# EAGLE schematic Johnson (EAGLE 8.5.1)
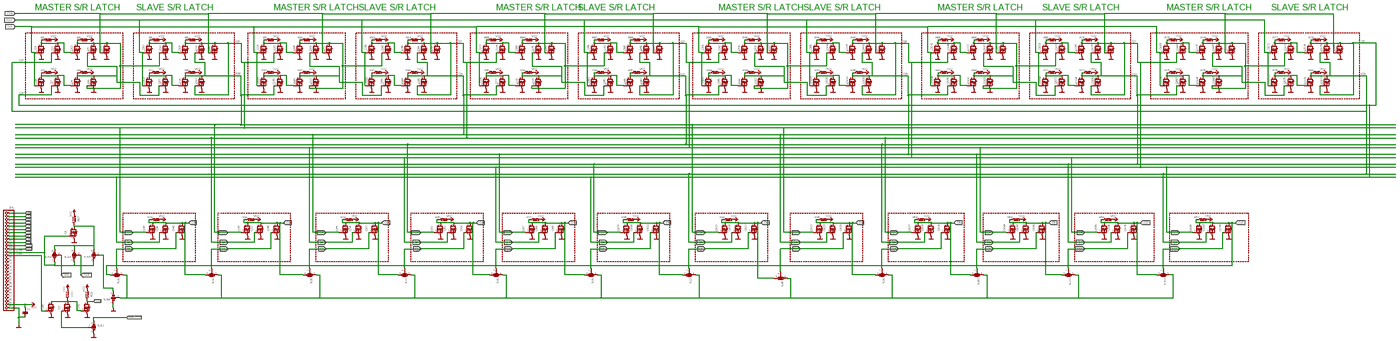
[diagram p0: schematic, sheet 1, overview]
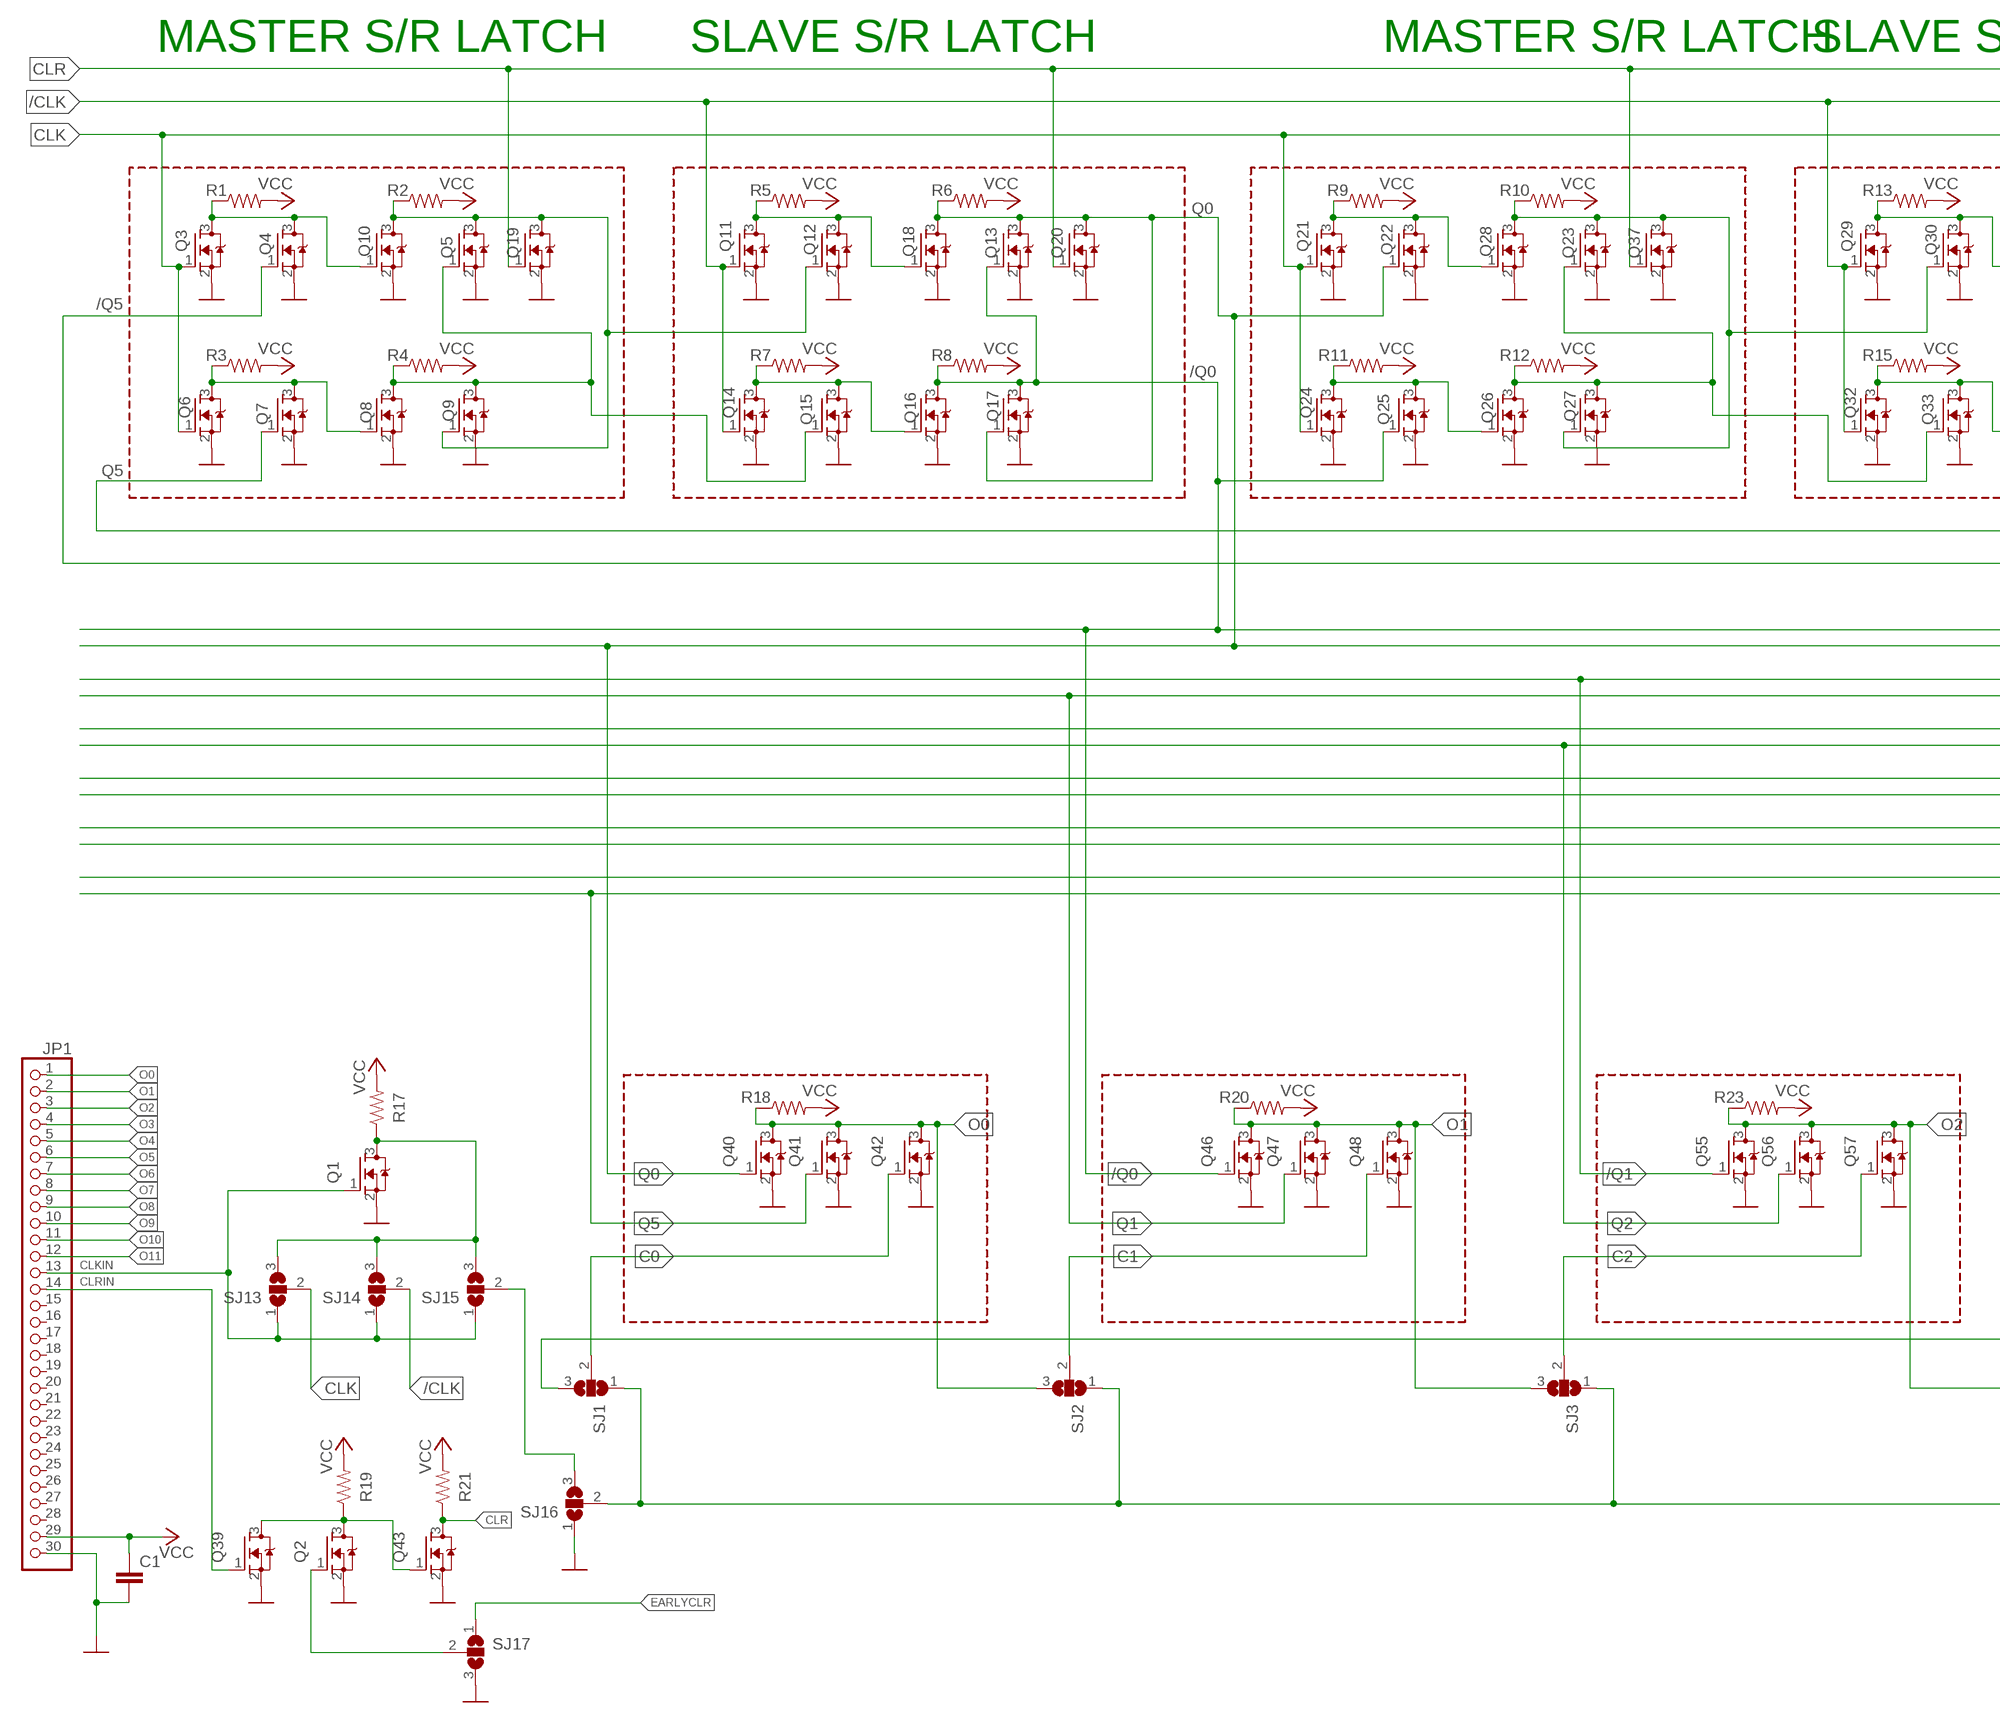
[diagram p1: schematic, sheet 1, part 1 of 4]
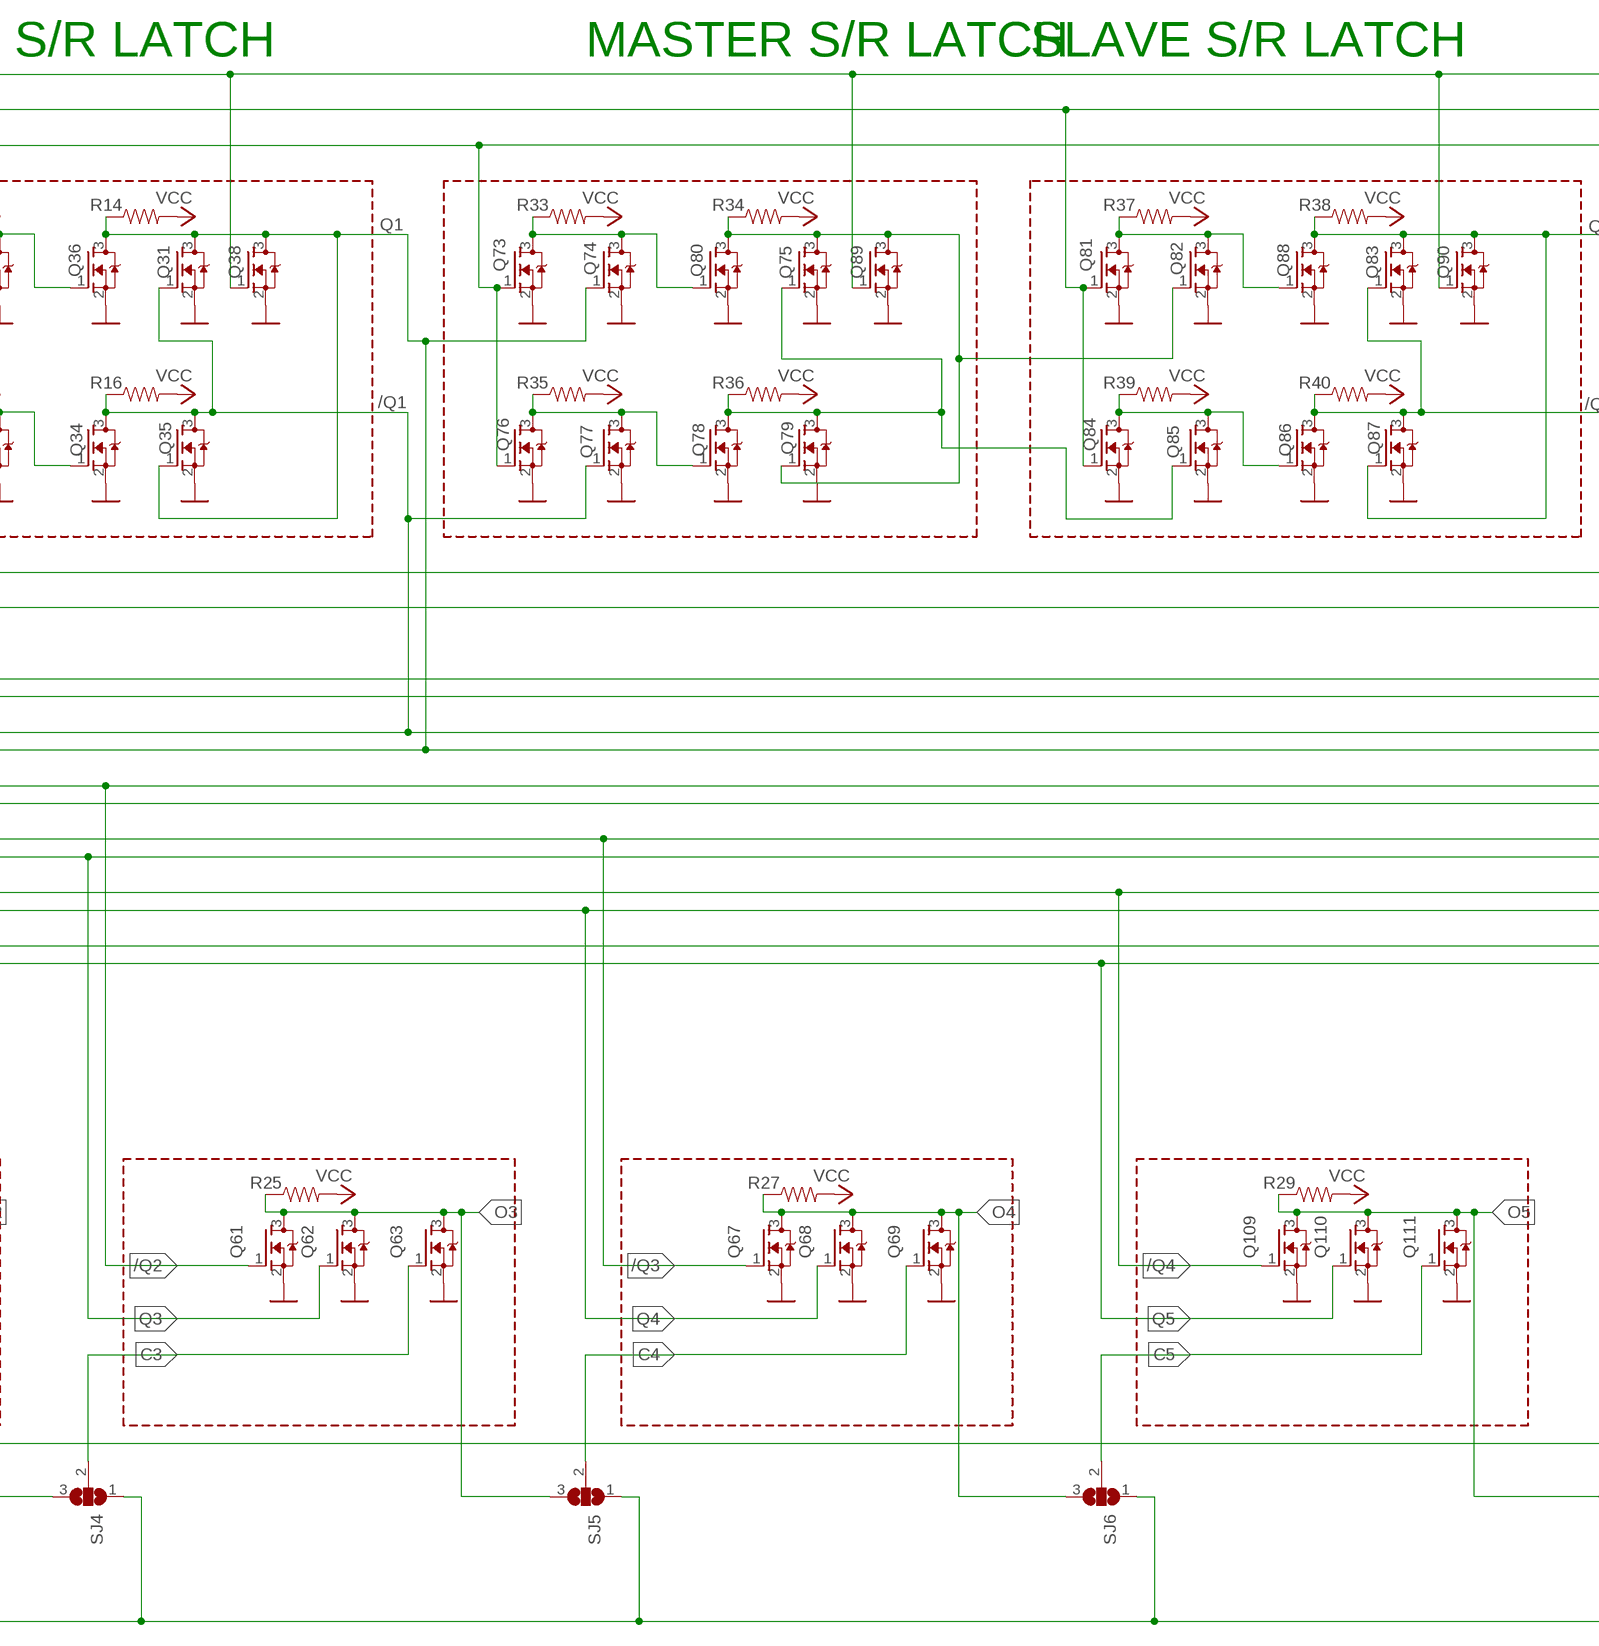
[diagram p2: schematic, sheet 1, part 2 of 4]
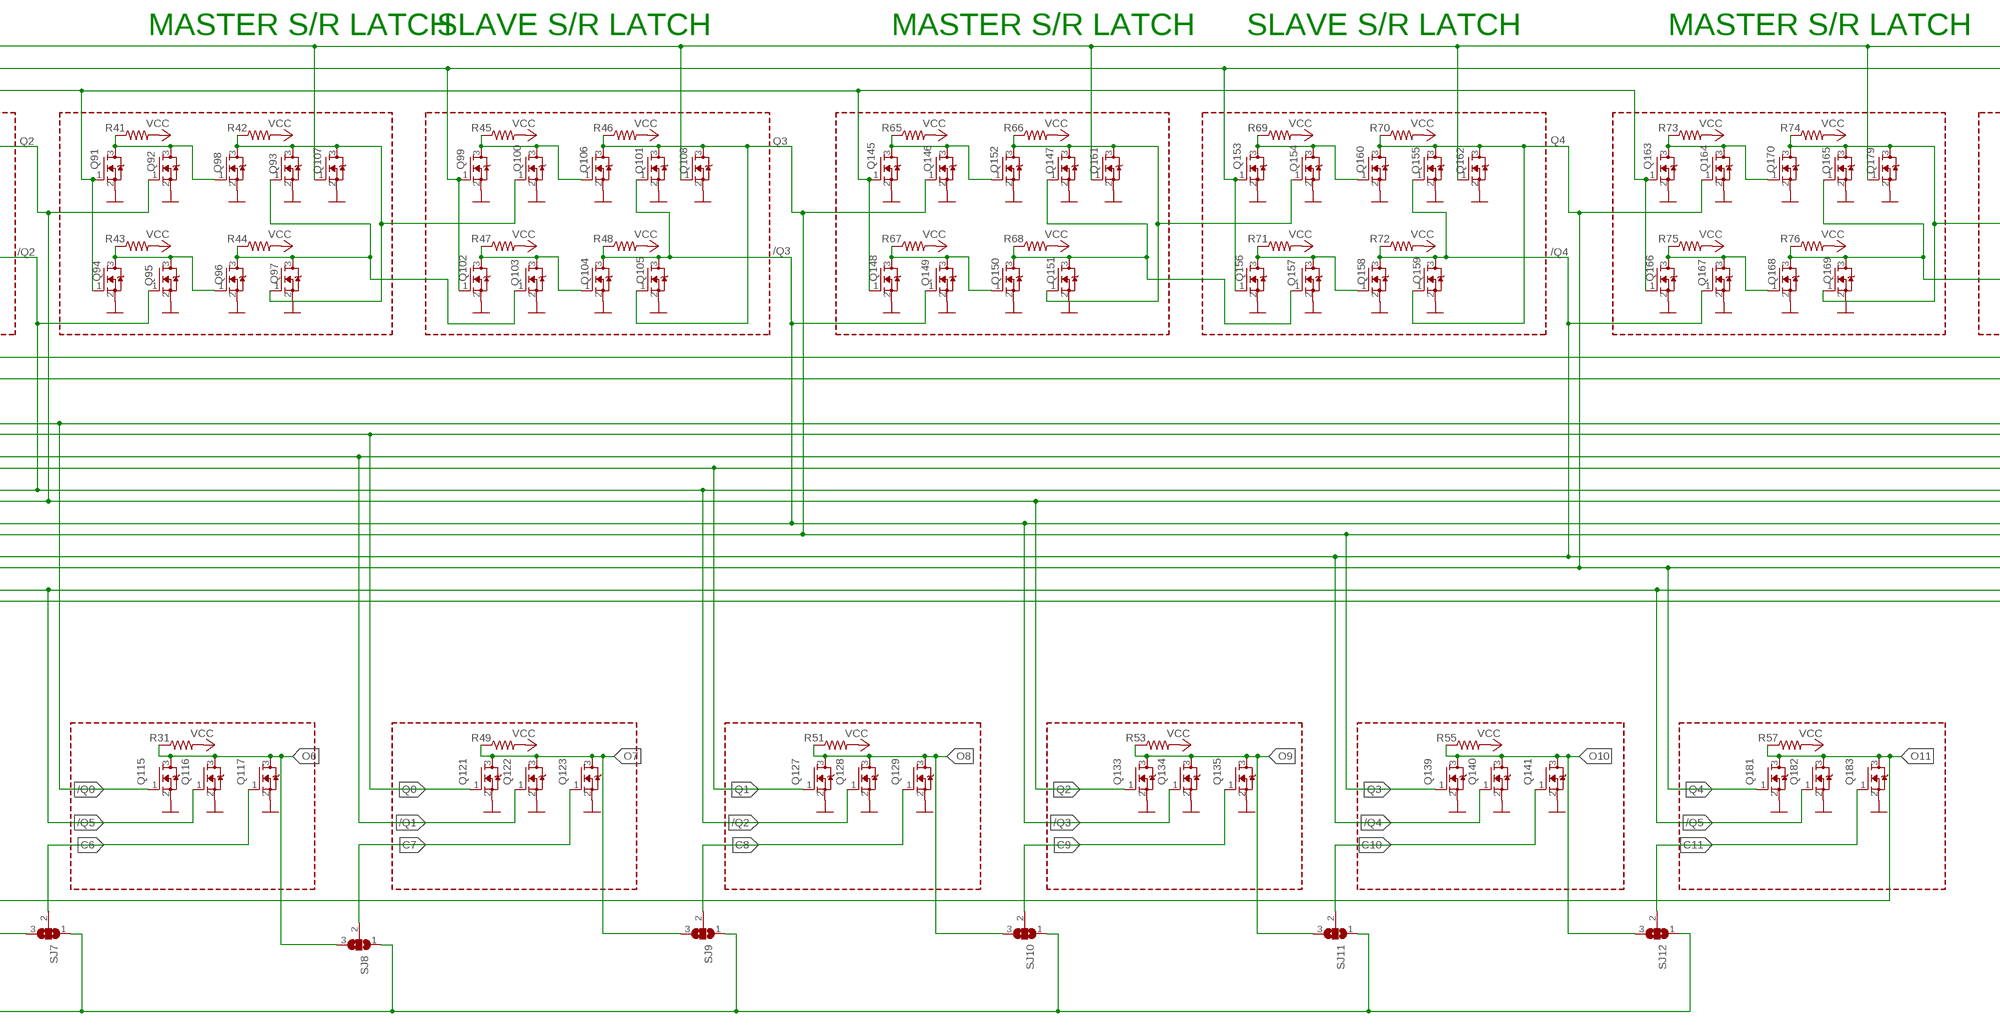
[diagram p3: schematic, sheet 1, part 3 of 4]
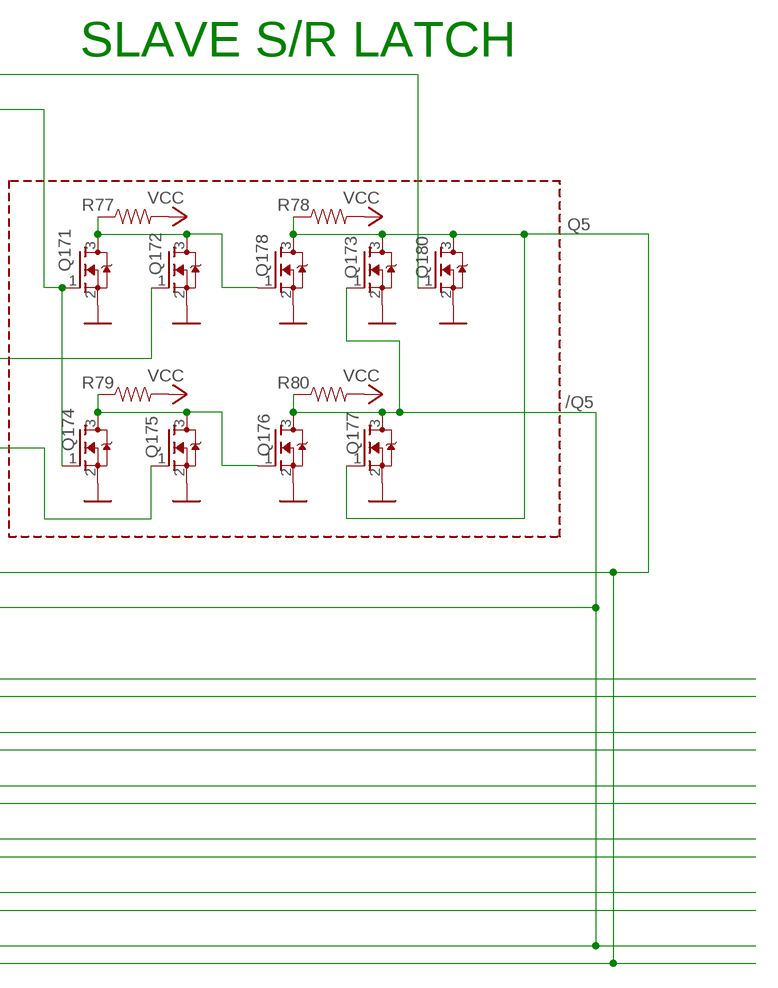
[diagram p4: schematic, sheet 1, part 4 of 4]

## Parts
C1  C-EUC0805  [C0805]
JP1  PINHD-1X30  [1X30]
Q1  310mA/60V/1.6Ω  NMOSREFLOW  [SOT23]
Q2  310mA/60V/1.6Ω  NMOSREFLOW  [SOT23]
Q3  310mA/60V/1.6Ω  NMOSREFLOW  [SOT23]
Q4  310mA/60V/1.6Ω  NMOSREFLOW  [SOT23]
Q5  310mA/60V/1.6Ω  NMOSREFLOW  [SOT23]
Q6  310mA/60V/1.6Ω  NMOSREFLOW  [SOT23]
Q7  310mA/60V/1.6Ω  NMOSREFLOW  [SOT23]
Q8  310mA/60V/1.6Ω  NMOSREFLOW  [SOT23]
Q9  310mA/60V/1.6Ω  NMOSREFLOW  [SOT23]
Q10  310mA/60V/1.6Ω  NMOSREFLOW  [SOT23]
Q11  310mA/60V/1.6Ω  NMOSREFLOW  [SOT23]
Q12  310mA/60V/1.6Ω  NMOSREFLOW  [SOT23]
Q13  310mA/60V/1.6Ω  NMOSREFLOW  [SOT23]
Q14  310mA/60V/1.6Ω  NMOSREFLOW  [SOT23]
Q15  310mA/60V/1.6Ω  NMOSREFLOW  [SOT23]
Q16  310mA/60V/1.6Ω  NMOSREFLOW  [SOT23]
Q17  310mA/60V/1.6Ω  NMOSREFLOW  [SOT23]
Q18  310mA/60V/1.6Ω  NMOSREFLOW  [SOT23]
Q19  310mA/60V/1.6Ω  NMOSREFLOW  [SOT23]
Q20  310mA/60V/1.6Ω  NMOSREFLOW  [SOT23]
Q21  310mA/60V/1.6Ω  NMOSREFLOW  [SOT23]
Q22  310mA/60V/1.6Ω  NMOSREFLOW  [SOT23]
Q23  310mA/60V/1.6Ω  NMOSREFLOW  [SOT23]
Q24  310mA/60V/1.6Ω  NMOSREFLOW  [SOT23]
Q25  310mA/60V/1.6Ω  NMOSREFLOW  [SOT23]
Q26  310mA/60V/1.6Ω  NMOSREFLOW  [SOT23]
Q27  310mA/60V/1.6Ω  NMOSREFLOW  [SOT23]
Q28  310mA/60V/1.6Ω  NMOSREFLOW  [SOT23]
Q29  310mA/60V/1.6Ω  NMOSREFLOW  [SOT23]
Q30  310mA/60V/1.6Ω  NMOSREFLOW  [SOT23]
Q31  310mA/60V/1.6Ω  NMOSREFLOW  [SOT23]
Q32  310mA/60V/1.6Ω  NMOSREFLOW  [SOT23]
Q33  310mA/60V/1.6Ω  NMOSREFLOW  [SOT23]
Q34  310mA/60V/1.6Ω  NMOSREFLOW  [SOT23]
Q35  310mA/60V/1.6Ω  NMOSREFLOW  [SOT23]
Q36  310mA/60V/1.6Ω  NMOSREFLOW  [SOT23]
Q37  310mA/60V/1.6Ω  NMOSREFLOW  [SOT23]
Q38  310mA/60V/1.6Ω  NMOSREFLOW  [SOT23]
Q39  310mA/60V/1.6Ω  NMOSREFLOW  [SOT23]
Q40  310mA/60V/1.6Ω  NMOSREFLOW  [SOT23]
Q41  310mA/60V/1.6Ω  NMOSREFLOW  [SOT23]
Q42  310mA/60V/1.6Ω  NMOSREFLOW  [SOT23]
Q43  310mA/60V/1.6Ω  NMOSREFLOW  [SOT23]
Q46  310mA/60V/1.6Ω  NMOSREFLOW  [SOT23]
Q47  310mA/60V/1.6Ω  NMOSREFLOW  [SOT23]
Q48  310mA/60V/1.6Ω  NMOSREFLOW  [SOT23]
Q55  310mA/60V/1.6Ω  NMOSREFLOW  [SOT23]
Q56  310mA/60V/1.6Ω  NMOSREFLOW  [SOT23]
Q57  310mA/60V/1.6Ω  NMOSREFLOW  [SOT23]
Q61  310mA/60V/1.6Ω  NMOSREFLOW  [SOT23]
Q62  310mA/60V/1.6Ω  NMOSREFLOW  [SOT23]
Q63  310mA/60V/1.6Ω  NMOSREFLOW  [SOT23]
Q67  310mA/60V/1.6Ω  NMOSREFLOW  [SOT23]
Q68  310mA/60V/1.6Ω  NMOSREFLOW  [SOT23]
Q69  310mA/60V/1.6Ω  NMOSREFLOW  [SOT23]
Q73  310mA/60V/1.6Ω  NMOSREFLOW  [SOT23]
Q74  310mA/60V/1.6Ω  NMOSREFLOW  [SOT23]
Q75  310mA/60V/1.6Ω  NMOSREFLOW  [SOT23]
Q76  310mA/60V/1.6Ω  NMOSREFLOW  [SOT23]
Q77  310mA/60V/1.6Ω  NMOSREFLOW  [SOT23]
Q78  310mA/60V/1.6Ω  NMOSREFLOW  [SOT23]
Q79  310mA/60V/1.6Ω  NMOSREFLOW  [SOT23]
Q80  310mA/60V/1.6Ω  NMOSREFLOW  [SOT23]
Q81  310mA/60V/1.6Ω  NMOSREFLOW  [SOT23]
Q82  310mA/60V/1.6Ω  NMOSREFLOW  [SOT23]
Q83  310mA/60V/1.6Ω  NMOSREFLOW  [SOT23]
Q84  310mA/60V/1.6Ω  NMOSREFLOW  [SOT23]
Q85  310mA/60V/1.6Ω  NMOSREFLOW  [SOT23]
Q86  310mA/60V/1.6Ω  NMOSREFLOW  [SOT23]
Q87  310mA/60V/1.6Ω  NMOSREFLOW  [SOT23]
Q88  310mA/60V/1.6Ω  NMOSREFLOW  [SOT23]
Q89  310mA/60V/1.6Ω  NMOSREFLOW  [SOT23]
Q90  310mA/60V/1.6Ω  NMOSREFLOW  [SOT23]
Q91  310mA/60V/1.6Ω  NMOSREFLOW  [SOT23]
Q92  310mA/60V/1.6Ω  NMOSREFLOW  [SOT23]
Q93  310mA/60V/1.6Ω  NMOSREFLOW  [SOT23]
Q94  310mA/60V/1.6Ω  NMOSREFLOW  [SOT23]
Q95  310mA/60V/1.6Ω  NMOSREFLOW  [SOT23]
Q96  310mA/60V/1.6Ω  NMOSREFLOW  [SOT23]
Q97  310mA/60V/1.6Ω  NMOSREFLOW  [SOT23]
Q98  310mA/60V/1.6Ω  NMOSREFLOW  [SOT23]
Q99  310mA/60V/1.6Ω  NMOSREFLOW  [SOT23]
Q100  310mA/60V/1.6Ω  NMOSREFLOW  [SOT23]
Q101  310mA/60V/1.6Ω  NMOSREFLOW  [SOT23]
Q102  310mA/60V/1.6Ω  NMOSREFLOW  [SOT23]
Q103  310mA/60V/1.6Ω  NMOSREFLOW  [SOT23]
Q104  310mA/60V/1.6Ω  NMOSREFLOW  [SOT23]
Q105  310mA/60V/1.6Ω  NMOSREFLOW  [SOT23]
Q106  310mA/60V/1.6Ω  NMOSREFLOW  [SOT23]
Q107  310mA/60V/1.6Ω  NMOSREFLOW  [SOT23]
Q108  310mA/60V/1.6Ω  NMOSREFLOW  [SOT23]
Q109  310mA/60V/1.6Ω  NMOSREFLOW  [SOT23]
Q110  310mA/60V/1.6Ω  NMOSREFLOW  [SOT23]
Q111  310mA/60V/1.6Ω  NMOSREFLOW  [SOT23]
Q115  310mA/60V/1.6Ω  NMOSREFLOW  [SOT23]
Q116  310mA/60V/1.6Ω  NMOSREFLOW  [SOT23]
Q117  310mA/60V/1.6Ω  NMOSREFLOW  [SOT23]
Q121  310mA/60V/1.6Ω  NMOSREFLOW  [SOT23]
Q122  310mA/60V/1.6Ω  NMOSREFLOW  [SOT23]
Q123  310mA/60V/1.6Ω  NMOSREFLOW  [SOT23]
Q127  310mA/60V/1.6Ω  NMOSREFLOW  [SOT23]
Q128  310mA/60V/1.6Ω  NMOSREFLOW  [SOT23]
Q129  310mA/60V/1.6Ω  NMOSREFLOW  [SOT23]
Q133  310mA/60V/1.6Ω  NMOSREFLOW  [SOT23]
Q134  310mA/60V/1.6Ω  NMOSREFLOW  [SOT23]
Q135  310mA/60V/1.6Ω  NMOSREFLOW  [SOT23]
Q139  310mA/60V/1.6Ω  NMOSREFLOW  [SOT23]
Q140  310mA/60V/1.6Ω  NMOSREFLOW  [SOT23]
Q141  310mA/60V/1.6Ω  NMOSREFLOW  [SOT23]
Q145  310mA/60V/1.6Ω  NMOSREFLOW  [SOT23]
Q146  310mA/60V/1.6Ω  NMOSREFLOW  [SOT23]
Q147  310mA/60V/1.6Ω  NMOSREFLOW  [SOT23]
Q148  310mA/60V/1.6Ω  NMOSREFLOW  [SOT23]
Q149  310mA/60V/1.6Ω  NMOSREFLOW  [SOT23]
Q150  310mA/60V/1.6Ω  NMOSREFLOW  [SOT23]
Q151  310mA/60V/1.6Ω  NMOSREFLOW  [SOT23]
Q152  310mA/60V/1.6Ω  NMOSREFLOW  [SOT23]
Q153  310mA/60V/1.6Ω  NMOSREFLOW  [SOT23]
Q154  310mA/60V/1.6Ω  NMOSREFLOW  [SOT23]
Q155  310mA/60V/1.6Ω  NMOSREFLOW  [SOT23]
Q156  310mA/60V/1.6Ω  NMOSREFLOW  [SOT23]
Q157  310mA/60V/1.6Ω  NMOSREFLOW  [SOT23]
Q158  310mA/60V/1.6Ω  NMOSREFLOW  [SOT23]
Q159  310mA/60V/1.6Ω  NMOSREFLOW  [SOT23]
Q160  310mA/60V/1.6Ω  NMOSREFLOW  [SOT23]
Q161  310mA/60V/1.6Ω  NMOSREFLOW  [SOT23]
Q162  310mA/60V/1.6Ω  NMOSREFLOW  [SOT23]
Q163  310mA/60V/1.6Ω  NMOSREFLOW  [SOT23]
Q164  310mA/60V/1.6Ω  NMOSREFLOW  [SOT23]
Q165  310mA/60V/1.6Ω  NMOSREFLOW  [SOT23]
Q166  310mA/60V/1.6Ω  NMOSREFLOW  [SOT23]
Q167  310mA/60V/1.6Ω  NMOSREFLOW  [SOT23]
Q168  310mA/60V/1.6Ω  NMOSREFLOW  [SOT23]
Q169  310mA/60V/1.6Ω  NMOSREFLOW  [SOT23]
Q170  310mA/60V/1.6Ω  NMOSREFLOW  [SOT23]
Q171  310mA/60V/1.6Ω  NMOSREFLOW  [SOT23]
Q172  310mA/60V/1.6Ω  NMOSREFLOW  [SOT23]
Q173  310mA/60V/1.6Ω  NMOSREFLOW  [SOT23]
Q174  310mA/60V/1.6Ω  NMOSREFLOW  [SOT23]
Q175  310mA/60V/1.6Ω  NMOSREFLOW  [SOT23]
Q176  310mA/60V/1.6Ω  NMOSREFLOW  [SOT23]
Q177  310mA/60V/1.6Ω  NMOSREFLOW  [SOT23]
Q178  310mA/60V/1.6Ω  NMOSREFLOW  [SOT23]
Q179  310mA/60V/1.6Ω  NMOSREFLOW  [SOT23]
Q180  310mA/60V/1.6Ω  NMOSREFLOW  [SOT23]
Q181  310mA/60V/1.6Ω  NMOSREFLOW  [SOT23]
Q182  310mA/60V/1.6Ω  NMOSREFLOW  [SOT23]
Q183  310mA/60V/1.6Ω  NMOSREFLOW  [SOT23]
R1  RESISTOR0805  [0805]
R2  RESISTOR0805  [0805]
R3  RESISTOR0805  [0805]
R4  RESISTOR0805  [0805]
R5  RESISTOR0805  [0805]
R6  RESISTOR0805  [0805]
R7  RESISTOR0805  [0805]
R8  RESISTOR0805  [0805]
R9  RESISTOR0805  [0805]
R10  RESISTOR0805  [0805]
R11  RESISTOR0805  [0805]
R12  RESISTOR0805  [0805]
R13  RESISTOR0805  [0805]
R14  RESISTOR0805  [0805]
R15  RESISTOR0805  [0805]
R16  RESISTOR0805  [0805]
R17  RESISTOR0805  [0805]
R18  RESISTOR0805  [0805]
R19  RESISTOR0805  [0805]
R20  RESISTOR0805  [0805]
R21  RESISTOR0805  [0805]
R23  RESISTOR0805  [0805]
R25  RESISTOR0805  [0805]
R27  RESISTOR0805  [0805]
R29  RESISTOR0805  [0805]
R31  RESISTOR0805  [0805]
R33  RESISTOR0805  [0805]
R34  RESISTOR0805  [0805]
R35  RESISTOR0805  [0805]
R36  RESISTOR0805  [0805]
R37  RESISTOR0805  [0805]
R38  RESISTOR0805  [0805]
R39  RESISTOR0805  [0805]
R40  RESISTOR0805  [0805]
R41  RESISTOR0805  [0805]
R42  RESISTOR0805  [0805]
R43  RESISTOR0805  [0805]
R44  RESISTOR0805  [0805]
R45  RESISTOR0805  [0805]
R46  RESISTOR0805  [0805]
R47  RESISTOR0805  [0805]
R48  RESISTOR0805  [0805]
R49  RESISTOR0805  [0805]
R51  RESISTOR0805  [0805]
R53  RESISTOR0805  [0805]
R55  RESISTOR0805  [0805]
R57  RESISTOR0805  [0805]
R65  RESISTOR0805  [0805]
R66  RESISTOR0805  [0805]
R67  RESISTOR0805  [0805]
R68  RESISTOR0805  [0805]
R69  RESISTOR0805  [0805]
R70  RESISTOR0805  [0805]
R71  RESISTOR0805  [0805]
R72  RESISTOR0805  [0805]
R73  RESISTOR0805  [0805]
R74  RESISTOR0805  [0805]
R75  RESISTOR0805  [0805]
R76  RESISTOR0805  [0805]
R77  RESISTOR0805  [0805]
R78  RESISTOR0805  [0805]
R79  RESISTOR0805  [0805]
R80  RESISTOR0805  [0805]
SJ1  SJ2W  [SJ_2]
SJ2  SJ2W  [SJ_2]
SJ3  SJ2W  [SJ_2]
SJ4  SJ2W  [SJ_2]
SJ5  SJ2W  [SJ_2]
SJ6  SJ2W  [SJ_2]
SJ7  SJ2W  [SJ_2]
SJ8  SJ2W  [SJ_2]
SJ9  SJ2W  [SJ_2]
SJ10  SJ2W  [SJ_2]
SJ11  SJ2W  [SJ_2]
SJ12  SJ2W  [SJ_2]
SJ13  SJ2W  [SJ_2]
SJ14  SJ2W  [SJ_2]
SJ15  SJ2W  [SJ_2]
SJ16  SJ2W  [SJ_2]
SJ17  SJ2W  [SJ_2]

## Nets
/CLK: Q11.1(G) Q14.1(G) Q29.1(G) Q32.1(G) Q81.1(G) Q84.1(G) Q99.1(G) Q102.1(G) Q153.1(G) Q156.1(G) Q171.1(G) Q174.1(G) SJ14.2
/Q0: Q13.1(G) Q16.3(D) Q17.3(D) Q25.1(G) Q46.1(G) Q115.1(G) R8.1
/Q1: Q31.1(G) Q34.3(D) Q35.3(D) Q55.1(G) Q77.1(G) Q122.1(G) R16.1
/Q2: Q61.1(G) Q83.1(G) Q86.3(D) Q87.3(D) Q95.1(G) Q128.1(G) R40.1
/Q3: Q67.1(G) Q101.1(G) Q104.3(D) Q105.3(D) Q134.1(G) Q149.1(G) R48.1
/Q4: Q109.1(G) Q140.1(G) Q155.1(G) Q158.3(D) Q159.3(D) Q167.1(G) R72.1
/Q5: Q4.1(G) Q116.1(G) Q173.1(G) Q176.3(D) Q177.3(D) Q182.1(G) R80.1
C0: Q42.1(G) SJ1.2
C1: Q48.1(G) SJ2.2
C2: Q57.1(G) SJ3.2
C3: Q63.1(G) SJ4.2
C4: Q69.1(G) SJ5.2
C5: Q111.1(G) SJ6.2
C6: Q117.1(G) SJ7.2
C7: Q123.1(G) SJ8.2
C8: Q129.1(G) SJ9.2
C9: Q135.1(G) SJ10.2
C10: Q141.1(G) SJ11.2
C11: Q183.1(G) SJ12.2
CLK: Q3.1(G) Q6.1(G) Q21.1(G) Q24.1(G) Q73.1(G) Q76.1(G) Q91.1(G) Q94.1(G) Q145.1(G) Q148.1(G) Q163.1(G) Q166.1(G) SJ13.2
CLKIN: JP1.13 Q1.1(G) SJ13.1 SJ14.1 SJ15.1
CLR: Q19.1(G) Q20.1(G) Q37.1(G) Q38.1(G) Q43.3(D) Q89.1(G) Q90.1(G) Q107.1(G) Q108.1(G) Q161.1(G) Q162.1(G) Q179.1(G) Q180.1(G) R21.1
CLRIN: JP1.14 Q39.1(G)
EARLYCLR: SJ17.1
GND: C1.2 JP1.30 Q1.2(S) Q2.2(S) Q3.2(S) Q4.2(S) Q5.2(S) Q6.2(S) Q7.2(S) Q8.2(S) Q9.2(S) Q10.2(S) Q11.2(S) Q12.2(S) Q13.2(S) Q14.2(S) Q15.2(S) Q16.2(S) Q17.2(S) Q18.2(S) Q19.2(S) Q20.2(S) Q21.2(S) Q22.2(S) Q23.2(S) Q24.2(S) Q25.2(S) Q26.2(S) Q27.2(S) Q28.2(S) Q29.2(S) Q30.2(S) Q31.2(S) Q32.2(S) Q33.2(S) Q34.2(S) Q35.2(S) Q36.2(S) Q37.2(S) Q38.2(S) Q39.2(S) Q40.2(S) Q41.2(S) Q42.2(S) Q43.2(S) Q46.2(S) Q47.2(S) Q48.2(S) Q55.2(S) Q56.2(S) Q57.2(S) Q61.2(S) Q62.2(S) Q63.2(S) Q67.2(S) Q68.2(S) Q69.2(S) Q73.2(S) Q74.2(S) Q75.2(S) Q76.2(S) Q77.2(S) Q78.2(S) Q79.2(S) Q80.2(S) Q81.2(S) Q82.2(S) Q83.2(S) Q84.2(S) Q85.2(S) Q86.2(S) Q87.2(S) Q88.2(S) Q89.2(S) Q90.2(S) Q91.2(S) Q92.2(S) Q93.2(S) Q94.2(S) Q95.2(S) Q96.2(S) Q97.2(S) Q98.2(S) Q99.2(S) Q100.2(S) Q101.2(S) Q102.2(S) Q103.2(S) Q104.2(S) Q105.2(S) Q106.2(S) Q107.2(S) Q108.2(S) Q109.2(S) Q110.2(S) Q111.2(S) Q115.2(S) Q116.2(S) Q117.2(S) Q121.2(S) Q122.2(S) Q123.2(S) Q127.2(S) Q128.2(S) Q129.2(S) Q133.2(S) Q134.2(S) Q135.2(S) Q139.2(S) Q140.2(S) Q141.2(S) Q145.2(S) Q146.2(S) Q147.2(S) Q148.2(S) Q149.2(S) Q150.2(S) Q151.2(S) Q152.2(S) Q153.2(S) Q154.2(S) Q155.2(S) Q156.2(S) Q157.2(S) Q158.2(S) Q159.2(S) Q160.2(S) Q161.2(S) Q162.2(S) Q163.2(S) Q164.2(S) Q165.2(S) Q166.2(S) Q167.2(S) Q168.2(S) Q169.2(S) Q170.2(S) Q171.2(S) Q172.2(S) Q173.2(S) Q174.2(S) Q175.2(S) Q176.2(S) Q177.2(S) Q178.2(S) Q179.2(S) Q180.2(S) Q181.2(S) Q182.2(S) Q183.2(S) SJ16.1 SJ17.3
N$1: SJ1.1 SJ2.1 SJ3.1 SJ4.1 SJ5.1 SJ6.1 SJ7.1 SJ8.1 SJ9.1 SJ10.1 SJ11.1 SJ12.1 SJ16.2
N$2: Q3.3(D) Q4.3(D) Q10.1(G) R1.1
N$3: SJ15.2 SJ16.3
N$4: Q6.3(D) Q7.3(D) Q8.1(G) R3.1
N$5: Q1.3(D) R17.1 SJ13.3 SJ14.3 SJ15.3
N$6: Q2.3(D) Q39.3(D) Q43.1(G) R19.1
N$7: Q11.3(D) Q12.3(D) Q18.1(G) R5.1
N$8: Q14.3(D) Q15.3(D) Q16.1(G) R7.1
N$9: Q5.3(D) Q9.1(G) Q10.3(D) Q12.1(G) Q19.3(D) R2.1
N$10: Q5.1(G) Q8.3(D) Q9.3(D) Q15.1(G) R4.1
N$11: Q21.3(D) Q22.3(D) Q28.1(G) R9.1
N$12: Q24.3(D) Q25.3(D) Q26.1(G) R11.1
N$13: Q29.3(D) Q30.3(D) Q36.1(G) R13.1
N$14: Q32.3(D) Q33.3(D) Q34.1(G) R15.1
N$15: Q23.3(D) Q27.1(G) Q28.3(D) Q30.1(G) Q37.3(D) R10.1
N$16: Q23.1(G) Q26.3(D) Q27.3(D) Q33.1(G) R12.1
N$17: Q2.1(G) SJ17.2
N$25: Q73.3(D) Q74.3(D) Q80.1(G) R33.1
N$26: Q76.3(D) Q77.3(D) Q78.1(G) R35.1
N$27: Q81.3(D) Q82.3(D) Q88.1(G) R37.1
N$28: Q84.3(D) Q85.3(D) Q86.1(G) R39.1
N$29: Q75.3(D) Q79.1(G) Q80.3(D) Q82.1(G) Q89.3(D) R34.1
N$30: Q75.1(G) Q78.3(D) Q79.3(D) Q85.1(G) R36.1
N$31: Q91.3(D) Q92.3(D) Q98.1(G) R41.1
N$32: Q94.3(D) Q95.3(D) Q96.1(G) R43.1
N$33: Q99.3(D) Q100.3(D) Q106.1(G) R45.1
N$34: Q102.3(D) Q103.3(D) Q104.1(G) R47.1
N$35: Q93.3(D) Q97.1(G) Q98.3(D) Q100.1(G) Q107.3(D) R42.1
N$36: Q93.1(G) Q96.3(D) Q97.3(D) Q103.1(G) R44.1
N$49: Q145.3(D) Q146.3(D) Q152.1(G) R65.1
N$50: Q148.3(D) Q149.3(D) Q150.1(G) R67.1
N$51: Q153.3(D) Q154.3(D) Q160.1(G) R69.1
N$52: Q156.3(D) Q157.3(D) Q158.1(G) R71.1
N$53: Q147.3(D) Q151.1(G) Q152.3(D) Q154.1(G) Q161.3(D) R66.1
N$54: Q147.1(G) Q150.3(D) Q151.3(D) Q157.1(G) R68.1
N$55: Q163.3(D) Q164.3(D) Q170.1(G) R73.1
N$56: Q166.3(D) Q167.3(D) Q168.1(G) R75.1
N$57: Q171.3(D) Q172.3(D) Q178.1(G) R77.1
N$58: Q174.3(D) Q175.3(D) Q176.1(G) R79.1
N$59: Q165.3(D) Q169.1(G) Q170.3(D) Q172.1(G) Q179.3(D) R74.1
N$60: Q165.1(G) Q168.3(D) Q169.3(D) Q175.1(G) R76.1
O0: JP1.1 Q40.3(D) Q41.3(D) Q42.3(D) R18.1 SJ2.3
O1: JP1.2 Q46.3(D) Q47.3(D) Q48.3(D) R20.1 SJ3.3
O2: JP1.3 Q55.3(D) Q56.3(D) Q57.3(D) R23.1 SJ4.3
O3: JP1.4 Q61.3(D) Q62.3(D) Q63.3(D) R25.1 SJ5.3
O4: JP1.5 Q67.3(D) Q68.3(D) Q69.3(D) R27.1 SJ6.3
O5: JP1.6 Q109.3(D) Q110.3(D) Q111.3(D) R29.1 SJ7.3
O6: JP1.7 Q115.3(D) Q116.3(D) Q117.3(D) R31.1 SJ8.3
O7: JP1.8 Q121.3(D) Q122.3(D) Q123.3(D) R49.1 SJ9.3
O8: JP1.9 Q127.3(D) Q128.3(D) Q129.3(D) R51.1 SJ10.3
O9: JP1.10 Q133.3(D) Q134.3(D) Q135.3(D) R53.1 SJ11.3
O10: JP1.11 Q139.3(D) Q140.3(D) Q141.3(D) R55.1 SJ12.3
O11: JP1.12 Q181.3(D) Q182.3(D) Q183.3(D) R57.1 SJ1.3
Q0: Q13.3(D) Q17.1(G) Q18.3(D) Q20.3(D) Q22.1(G) Q40.1(G) Q121.1(G) R6.1
Q1: Q31.3(D) Q35.1(G) Q36.3(D) Q38.3(D) Q47.1(G) Q74.1(G) Q127.1(G) R14.1
Q2: Q56.1(G) Q83.3(D) Q87.1(G) Q88.3(D) Q90.3(D) Q92.1(G) Q133.1(G) R38.1
Q3: Q62.1(G) Q101.3(D) Q105.1(G) Q106.3(D) Q108.3(D) Q139.1(G) Q146.1(G) R46.1
Q4: Q68.1(G) Q155.3(D) Q159.1(G) Q160.3(D) Q162.3(D) Q164.1(G) Q181.1(G) R70.1
Q5: Q7.1(G) Q41.1(G) Q110.1(G) Q173.3(D) Q177.1(G) Q178.3(D) Q180.3(D) R78.1
VCC: C1.1 JP1.29 R1.2 R2.2 R3.2 R4.2 R5.2 R6.2 R7.2 R8.2 R9.2 R10.2 R11.2 R12.2 R13.2 R14.2 R15.2 R16.2 R17.2 R18.2 R19.2 R20.2 R21.2 R23.2 R25.2 R27.2 R29.2 R31.2 R33.2 R34.2 R35.2 R36.2 R37.2 R38.2 R39.2 R40.2 R41.2 R42.2 R43.2 R44.2 R45.2 R46.2 R47.2 R48.2 R49.2 R51.2 R53.2 R55.2 R57.2 R65.2 R66.2 R67.2 R68.2 R69.2 R70.2 R71.2 R72.2 R73.2 R74.2 R75.2 R76.2 R77.2 R78.2 R79.2 R80.2
Unconnected: JP1.15 JP1.16 JP1.17 JP1.18 JP1.19 JP1.20 JP1.21 JP1.22 JP1.23 JP1.24 JP1.25 JP1.26 JP1.27 JP1.28

## Notes on the sheet
- MASTER S/R LATCH
- SLAVE S/R LATCH | MASTER S/R LATCH | SLAVE S/R LATCH | MASTER S/R LATCH | SLAVE S/R LATCH | MASTER S/R LATCH | SLAVE S/R LATCH | MASTER S/R LATCH | SLAVE S/R LATCH | MASTER S/R LATCH | SLAVE S/R LATCH

## Library data of the parts
C1 = rcl:C-EU: CAPACITOR, European symbol; SPICEPREFIX: C
JP1 = XSNOR:PINHD-1X30: PIN HEADER
Q1 Q2 Q4-Q9 Q12-Q17 Q19 Q20 Q22-Q27 Q30-Q35 Q37-Q43 Q46-Q48 Q55-Q57 Q61-Q63 Q67-Q69 Q74-Q79 Q82-Q87 Q89 Q90 Q92-Q97 Q100-Q105 Q107-Q111 Q115-Q117 Q121-Q123 Q127-Q129 Q133-Q135 Q139-Q141 Q146-Q151 Q154-Q159 Q161 Q162 Q164-Q169 Q172-Q177 Q179-Q183 = XSNOR:NMOS: N-Channel Mosfet 2N7002E - 60V 260mA SOT23 [Digikey: 2N7002ET1GOSTR-ND] - REEL BSH103 - 30V 850mA SOT23 [Digikey: 568-5013-1-ND]
Q3 Q10 Q11 Q18 Q21 Q28 Q29 Q36 Q73 Q80 Q81 Q88 Q91 Q98 Q99 Q106 Q145 Q152 Q153 Q160 Q163 Q170 Q171 Q178 = XSNOR:NMOS: N-Channel Mosfet 2N7002E - 60V 260mA SOT23 [Digikey: 2N7002ET1GOSTR-ND] - REEL BSH103 - 30V 850mA SOT23 [Digikey: 568-5013-1-ND]; SPICEPREFIX: M
R1-R21 R23 R25 R27 R29 R31 R33-R49 R51 R53 R55 R57 R65-R80 = XSNOR:RESISTOR: Generic Resistor Package
SJ1-SJ17 = jumper:SJ2W: SMD solder JUMPER

## Net classes
0 default: width 0.2 mm, drill 0.305 mm, clearance 0.2 mm